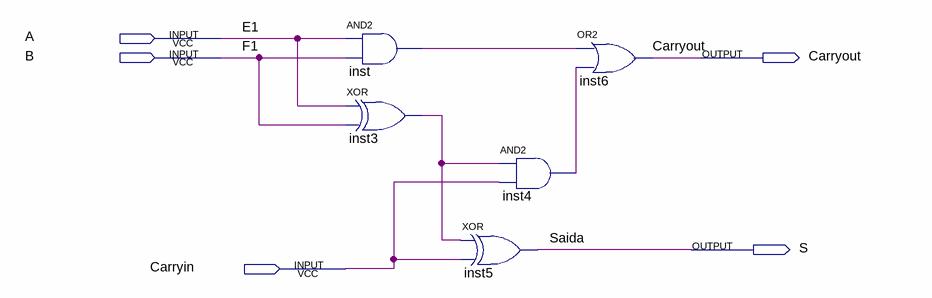
[diagram p0: schematic sheet]
// Quartus schematic somatop.bdf as structural Verilog: 5 symbols, 5 pins
module somatop (
  input  A,
  input  B,
  input  Carryin,
  output Carryout,
  output S
);

  wire inst3_out, inst4_out, inst_out;

  and inst (inst_out, A, B);
  xor inst3 (inst3_out, A, B);
  and inst4 (inst4_out, inst3_out, Carryin);
  xor inst5 (S, inst3_out, Carryin);
  or inst6 (Carryout, inst_out, inst4_out);

  // Other names for the same wires on the sheet: E1 = A; F1 = B; Saida = S
endmodule
